# EAGLE design RPi UART-USB Shim (EAGLE 7.3.0)
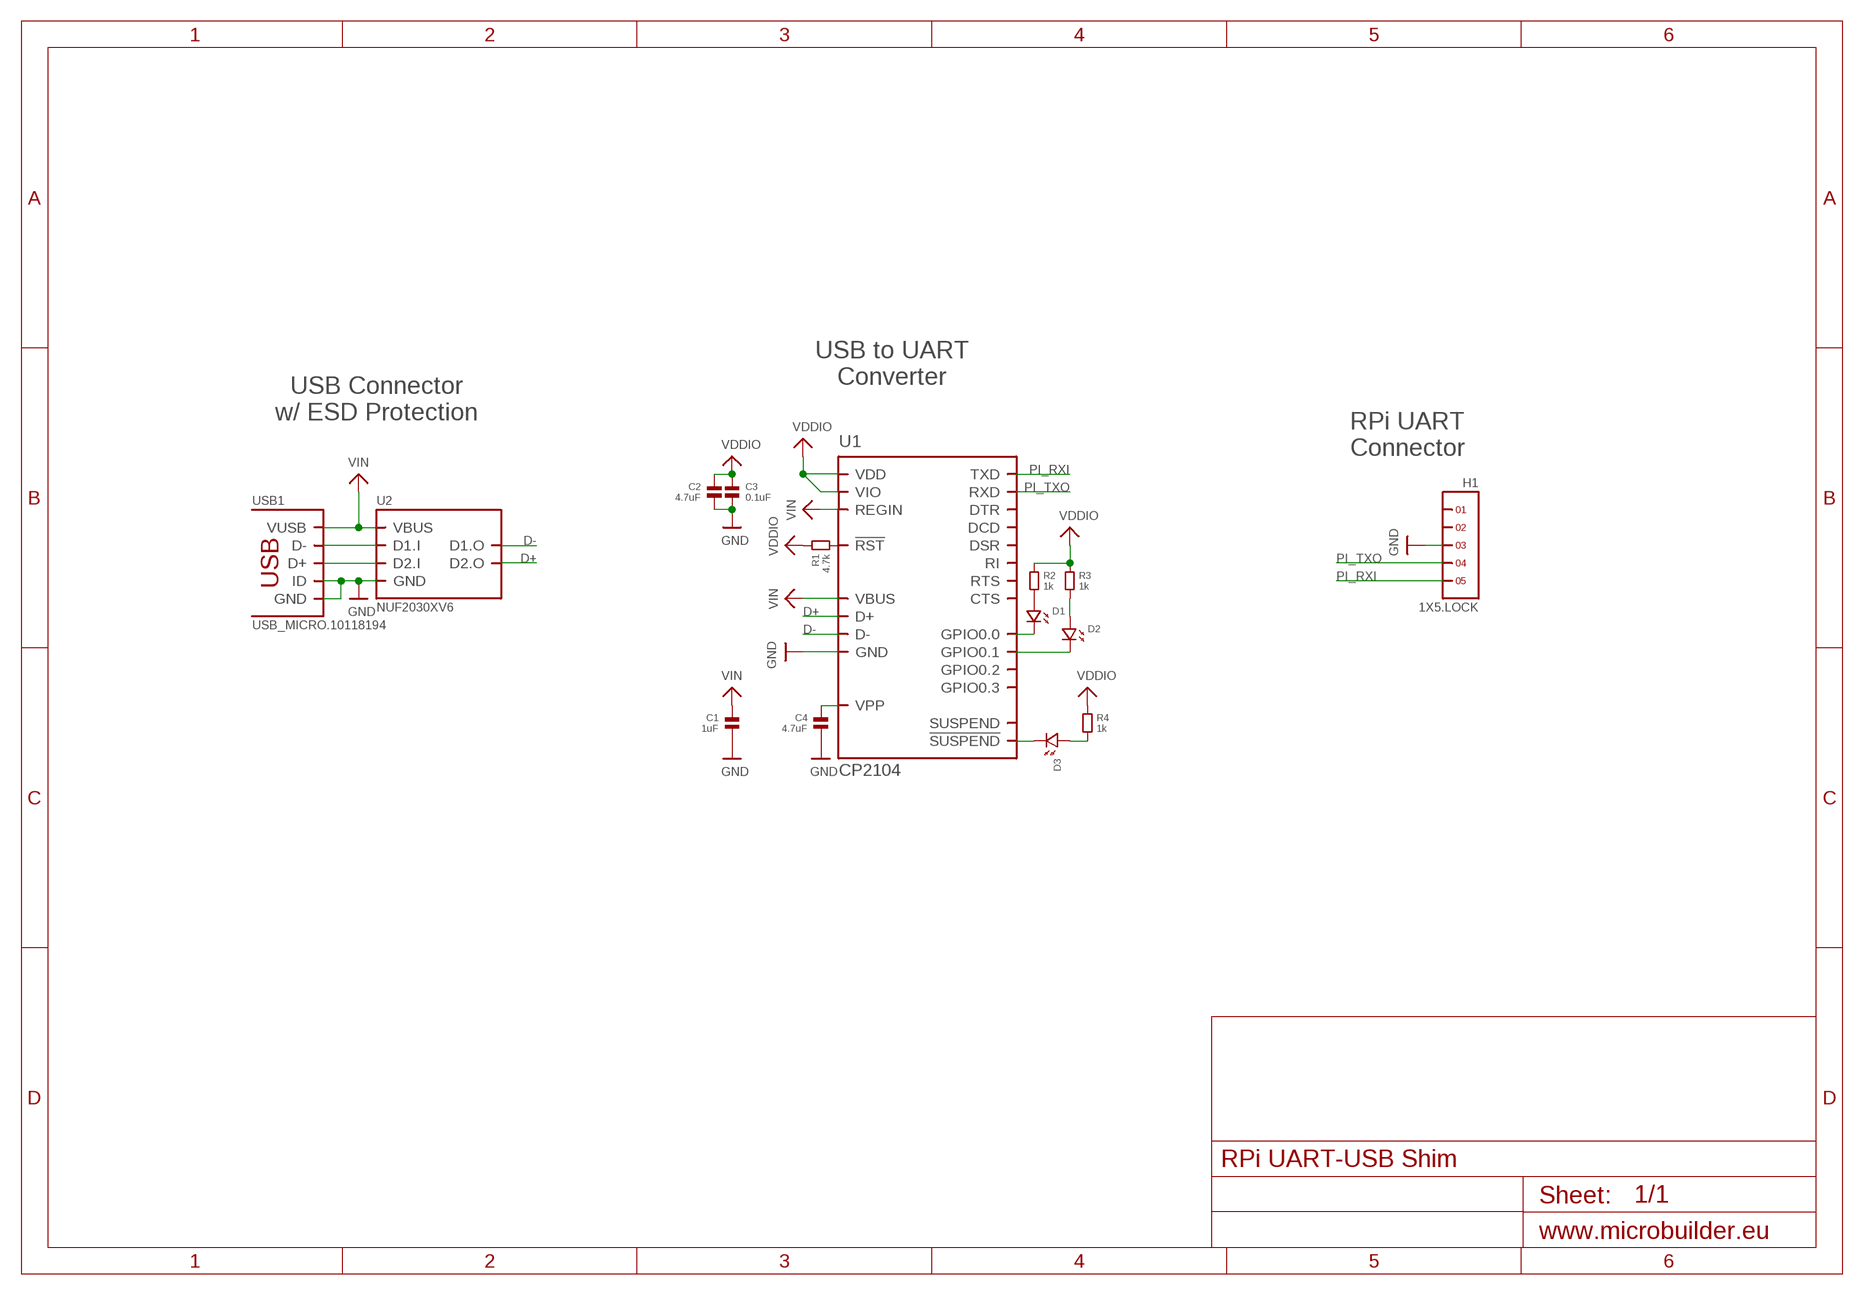
[diagram p0: schematic, sheet 1]

## Parts
C1  1uF  CAPACITOR.0402  [0402]
C2  4.7uF  CAPACITOR.0402  [0402]
C3  0.1uF  CAPACITOR.0402  [0402]
C4  4.7uF  CAPACITOR.0402  [0402]
D1  LED.0402  [0402.LED]
D2  LED.0402  [0402.LED]
D3  LED.0402  [0402.LED]
H1  1X5.LOCK  [1X5.LOCK]
R1  4.7k  RESISTOR.0402  [0402]
R2  1k  RESISTOR.0402  [0402]
R3  1k  RESISTOR.0402  [0402]
R4  1k  RESISTOR.0402  [0402]
U1  CP2104  [QFN24]
U2  NUF2030XV6  [SOT-563]
USB1  USB_MICRO.10118194  [10118194]

## Nets
D+: U1.3(D+) U2.4(D2.O)
D+.RAW: U2.3(D2.I) USB1.3(D+)
D-: U1.4(D-) U2.6(D1.O)
D-.RAW: U2.1(D1.I) USB1.2(D-)
GND: C1.2 C2.2 C3.2 C4.2 H1.3 U1.2(GND) U1.PAD(GND) U2.2(GND) USB1.4(ID) USB1.5(GND) USB1.PAD@1(GND) USB1.PAD@2(GND) USB1.PAD@3(GND) USB1.PAD@4(GND) USB1.PAD@5(GND) USB1.PAD@6(GND) USB1.PAD@7(GND) USB1.PAD@8(GND) USB1.PAD@9(GND) USB1.PAD@10(GND) USB1.PAD@11(GND) USB1.PAD@12(GND) USB1.PAD@13(GND) USB1.PAD@14(GND) USB1.PAD@15(GND) USB1.PAD@16(GND)
N$1: C4.1 U1.16(VPP)
N$2: R1.2 U1.9(!RST)
N$3: D1.P$1 R2.2
N$4: D1.P$2 U1.14(GPIO0.0)
N$5: D2.P$2 U1.13(GPIO0.1)
N$6: D2.P$1 R3.2
N$7: D3.P$1 R4.2
N$8: D3.P$2 U1.15(!SUSPEND)
PI_RXI: H1.5 U1.21(TXD)
PI_TXO: H1.4 U1.20(RXD)
VDDIO: C2.1 C3.1 R1.1 R2.1 R3.1 R4.1 U1.5(VIO) U1.6(VDD)
VIN: C1.1 U1.7(REGIN) U1.8(VBUS) U2.5(VBUS) USB1.1(VUSB)
Unconnected: H1.1 H1.2 U1.1(RI) U1.11(GPIO0.3) U1.12(GPIO0.2) U1.17(SUSPEND) U1.18(CTS) U1.19(RTS) U1.22(DSR) U1.23(DTR) U1.24(DCD)

## Notes on the sheet
- USB to UART
  Converter
- USB Connector
  w/ ESD Protection
- RPi UART
  Connector

## Library data of the parts
C1-C4 = standardparts:CAPACITOR
D1-D3 = standardparts:LED
H1 = headers(.1in):1X5
R1-R4 = standardparts:RESISTOR
U1 = silabs:CP2104
U2 = on-semiconductor:NUF2030XV6
USB1 = FCI:USB_MICRO

## Board
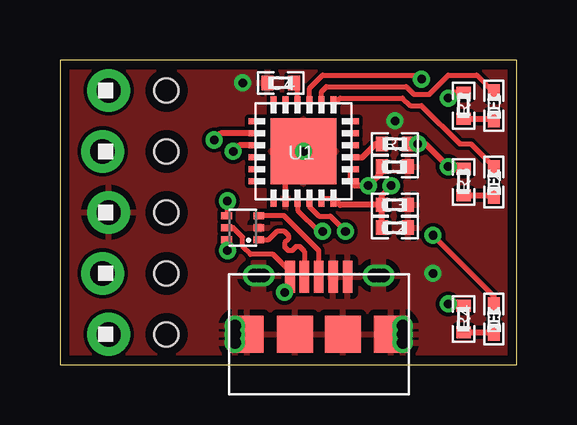
[diagram p1: board, top side]
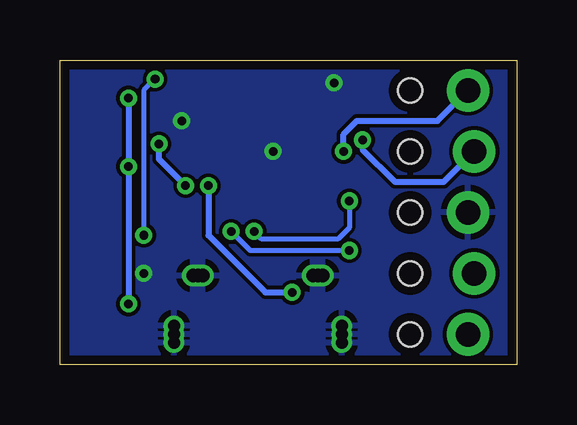
[diagram p2: board, bottom side, seen from below]

Size 19.05 x 12.7 mm. Coordinates in mm from the lower left corner, seen from the top.
Outline: 0,0 19.05,0 19.05,12.7 0,12.7 0,0
Copper layers (1*16): Top 0.0356mm / dielectric 1.5011mm / Bottom 0.0356mm
Design rules "OSHPark": minimum track width 6mil, minimum drill 13mil, track to track 6mil, track to pad 6mil, pad to pad 6mil, via to via 6mil, smd to smd 6mil, copper to edge 15mil, drill to drill 6mil, minimum pad ring 7mil, minimum via ring 7mil, stop-mask expansion 4mil, vias tented up to drill 16mil, thermal gap 10mil
Holes 1 mm at 4.45,11.43 4.45,8.89 4.45,6.35 4.45,3.81 4.45,1.27

### Footprints (pad centres in the part's own frame; a part is rotated, then mirrored left to right if it is on the bottom)
0402 = smd 0.5 x 0.6: 1 -0.55,0; 2 0.55,0
0402.LED = smd 0.7 x 0.5: P$1 -0.55,0; P$2 0.55,0
1X5.LOCK = drill 1.016 pad 1.778: 1 0,-0.127; 2 2.54,0.127; 3 5.08,-0.127; 4 7.62,0.127; 5 10.16,-0.127
QFN24 = smd 0.7 x 0.25: 1 -1.95,1.25; 2 -1.95,0.75; 3 -1.95,0.25; 4 -1.95,-0.25; 5 -1.95,-0.75; 6 -1.95,-1.25; 13 1.95,-1.25; 14 1.95,-0.75; 15 1.95,-0.25; 16 1.95,0.25; 17 1.95,0.75; 18 1.95,1.25 | smd 0.25 x 0.7: 7 -1.25,-1.95; 8 -0.75,-1.95; 9 -0.25,-1.95; 10 0.25,-1.95; 11 0.75,-1.95; 12 1.25,-1.95; 19 1.25,1.95; 20 0.75,1.95; 21 0.25,1.95; 22 -0.25,1.95; 23 -0.75,1.95; 24 -1.25,1.95 | smd 2.75 x 2.75: PAD 0,0
SOT-563 = smd 0.3 x 0.45: 1 -0.5,-0.675; 2 0,-0.675; 3 0.5,-0.675; 4 0.5,0.675; 5 0,0.675; 6 -0.5,0.675
10118194 = smd 0.4 x 1.35: 1 -1.2,2.4; 2 -0.6,2.4; 3 0,2.4; 4 0.6,2.4; 5 1.2,2.4 | smd 1.5 x 1.55: PAD@1 -1,0; PAD@2 1,0 | smd 1.4 x 1.55: PAD@3 -3,0; PAD@4 3,0 | drill 0.5: PAD@5 -3.5,-0.35; PAD@6 -3.5,0; PAD@7 -3.5,0.35; PAD@8 3.5,0.35; PAD@9 3.5,0; PAD@10 3.5,-0.35 | drill 0.55: PAD@11 2.7,2.45; PAD@12 2.5,2.45; PAD@13 2.3,2.45; PAD@14 -2.3,2.45; PAD@15 -2.5,2.45; PAD@16 -2.7,2.45

### Placement (x,y rotation side)
C1  13.97,8.26 0 top
C2  13.97,5.71 0 top
C3  13.97,6.67 0 top
C4  9.21,11.75 180 top
D1  18.1,10.79 90 top
D2  18.1,7.62 90 top
D3  18.1,1.91 90 top
H1  1.91,1.27 90 top
R1  13.97,9.21 180 top
R2  16.83,10.79 270 top
R3  16.83,7.62 270 top
R4  16.83,1.91 270 top
U1  10.16,8.89 90 top
U2  7.62,5.71 90 top
USB1  10.79,1.27 0 top

### Tracks (layer width: path | path; a pad name or v marks a point on that pad's centre or on a via)
D+  (via drill 0.36)
  Top 0.203: U2.4 6.99,6.25 v6.99,6.83 | U1.3 9.91,6.44 10.79,5.56 v10.95,5.56
  Bottom 0.203: v10.95,5.56 10.64,5.24 7.46,5.24 6.99,5.71 v6.99,6.83
D+.RAW
  Top 0.203: USB1.3 10.79,4.76 9.34,6.21 U2.3
D-  (via drill 0.36)
  Top 0.203: U2.6 6.95,4.8 v6.99,4.76 | v11.91,5.56 11.27,6.19 10.79,6.19 10.41,6.58 U1.4
  Bottom 0.203: v6.99,4.76 11.11,4.76 v11.91,5.56
D-.RAW
  Top 0.203: USB1.2 10.2,4.73 10,4.92 9.84,4.92 9.68,4.76 9.53,4.76 9.37,4.92 9.37,5.08 9.53,5.24 9.53,5.4 9.37,5.56 9.05,5.56 8.71,5.21 U2.1
GND  (via drill 0.36)
  Top 0.203: U1.2 9.41,8.14 U1.PAD
  other vias: 10.16,8.89 13.97,10.16 15.56,3.81 7.62,11.75
  pour Bottom (rank 6): 0,12.7 19.05,12.7 19.05,0 0,0
  pour Top (rank 6): 0,12.7 19.05,12.7 19.05,0 0,0
N$1
  Top 0.203: U1.16 9.91,11.6 C4.1
N$2
  Top 0.254: U1.9 12.61,8.64 13.18,9.21 R1.2
N$3
  Top 0.254: R2.2 D1.P$1
N$4
  Top 0.203: U1.14 10.91,11.39 11.11,11.59 14.45,11.59 14.76,11.27 15.4,11.27 16.19,12.06 17.38,12.06 D1.P$2
N$5
  Top 0.203: U1.13 11.68,11.11 14.29,11.11 14.61,10.79 15.08,10.79 16.67,9.21 17.14,9.21 18.1,8.26 D2.P$2
N$6
  Top 0.254: R3.2 D2.P$1
N$7
  Top 0.254: R4.2 D3.P$1
N$8  (via drill 0.36)
  Top 0.203: U1.15 10.41,11.52 10.95,12.06 14.92,12.06 v15.08,11.91 | v15.56,5.4 18.1,2.86 D3.P$2
  Bottom 0.203: v15.08,11.91 15.56,11.43 v15.56,5.4
PI_RXI  (via drill 0.36)
  Top 0.254: U1.21 7.47,9.14 v7.22,8.89
  Bottom 0.254: v7.22,8.89 7.22,9.6 6.67,10.16 3.3,10.16 H1.5
PI_TXO  (via drill 0.36)
  Top 0.254: U1.20 6.7,9.64 v6.43,9.37
  Bottom 0.254: v6.43,9.37 6.43,8.97 5.08,7.62 3.05,7.62 H1.4
VDDIO  (via drill 0.36)
  Top 0.203: U1.5 U1.6
  Top 0.254: C3.1 11.68,6.67 U1.6 | C2.1 C3.1 | v16.19,2.54 16.28,2.46 R4.1 | R3.1 16.28,8.17 v16.19,8.26 15.24,9.21 v14.92,9.21 R1.1 | C3.1 13.42,7.07 v13.81,7.46 | R2.1 16.43,11.35 v16.19,11.11
  Bottom 0.254: v16.19,11.11 v16.19,8.26 v16.19,2.54 | v13.81,7.46 14.92,8.57 v14.92,9.21
VIN  (via drill 0.36)
  Top 0.203: USB1.1 9.6,3.9 8.89,4.6 7.94,4.6 7.62,4.92 7.62,5.32 7.22,5.71 U2.5 | U1.7 U1.8
  Top 0.254: v9.37,3.02 9.6,3.25 USB1.1 | U1.7 12.29,7.46 v12.86,7.46 13.42,8.02 C1.1
  Bottom 0.254: v12.86,7.46 12.86,5.4 10.48,3.02 v9.37,3.02

### Text on the board
bDocu: RPi UART / USB Shim | Cruz Monrreal II